# Altium schematic sheet AudioDriver.schDOC
size A3; Organization: Altium Limited; Address1: L3, 12a Rodborough Rd; Address2: Frenchs Forest; Address3: NSW; Address4: Australia 2086; DocumentNumber: 18; SheetNumber: 18; SheetTotal: 22
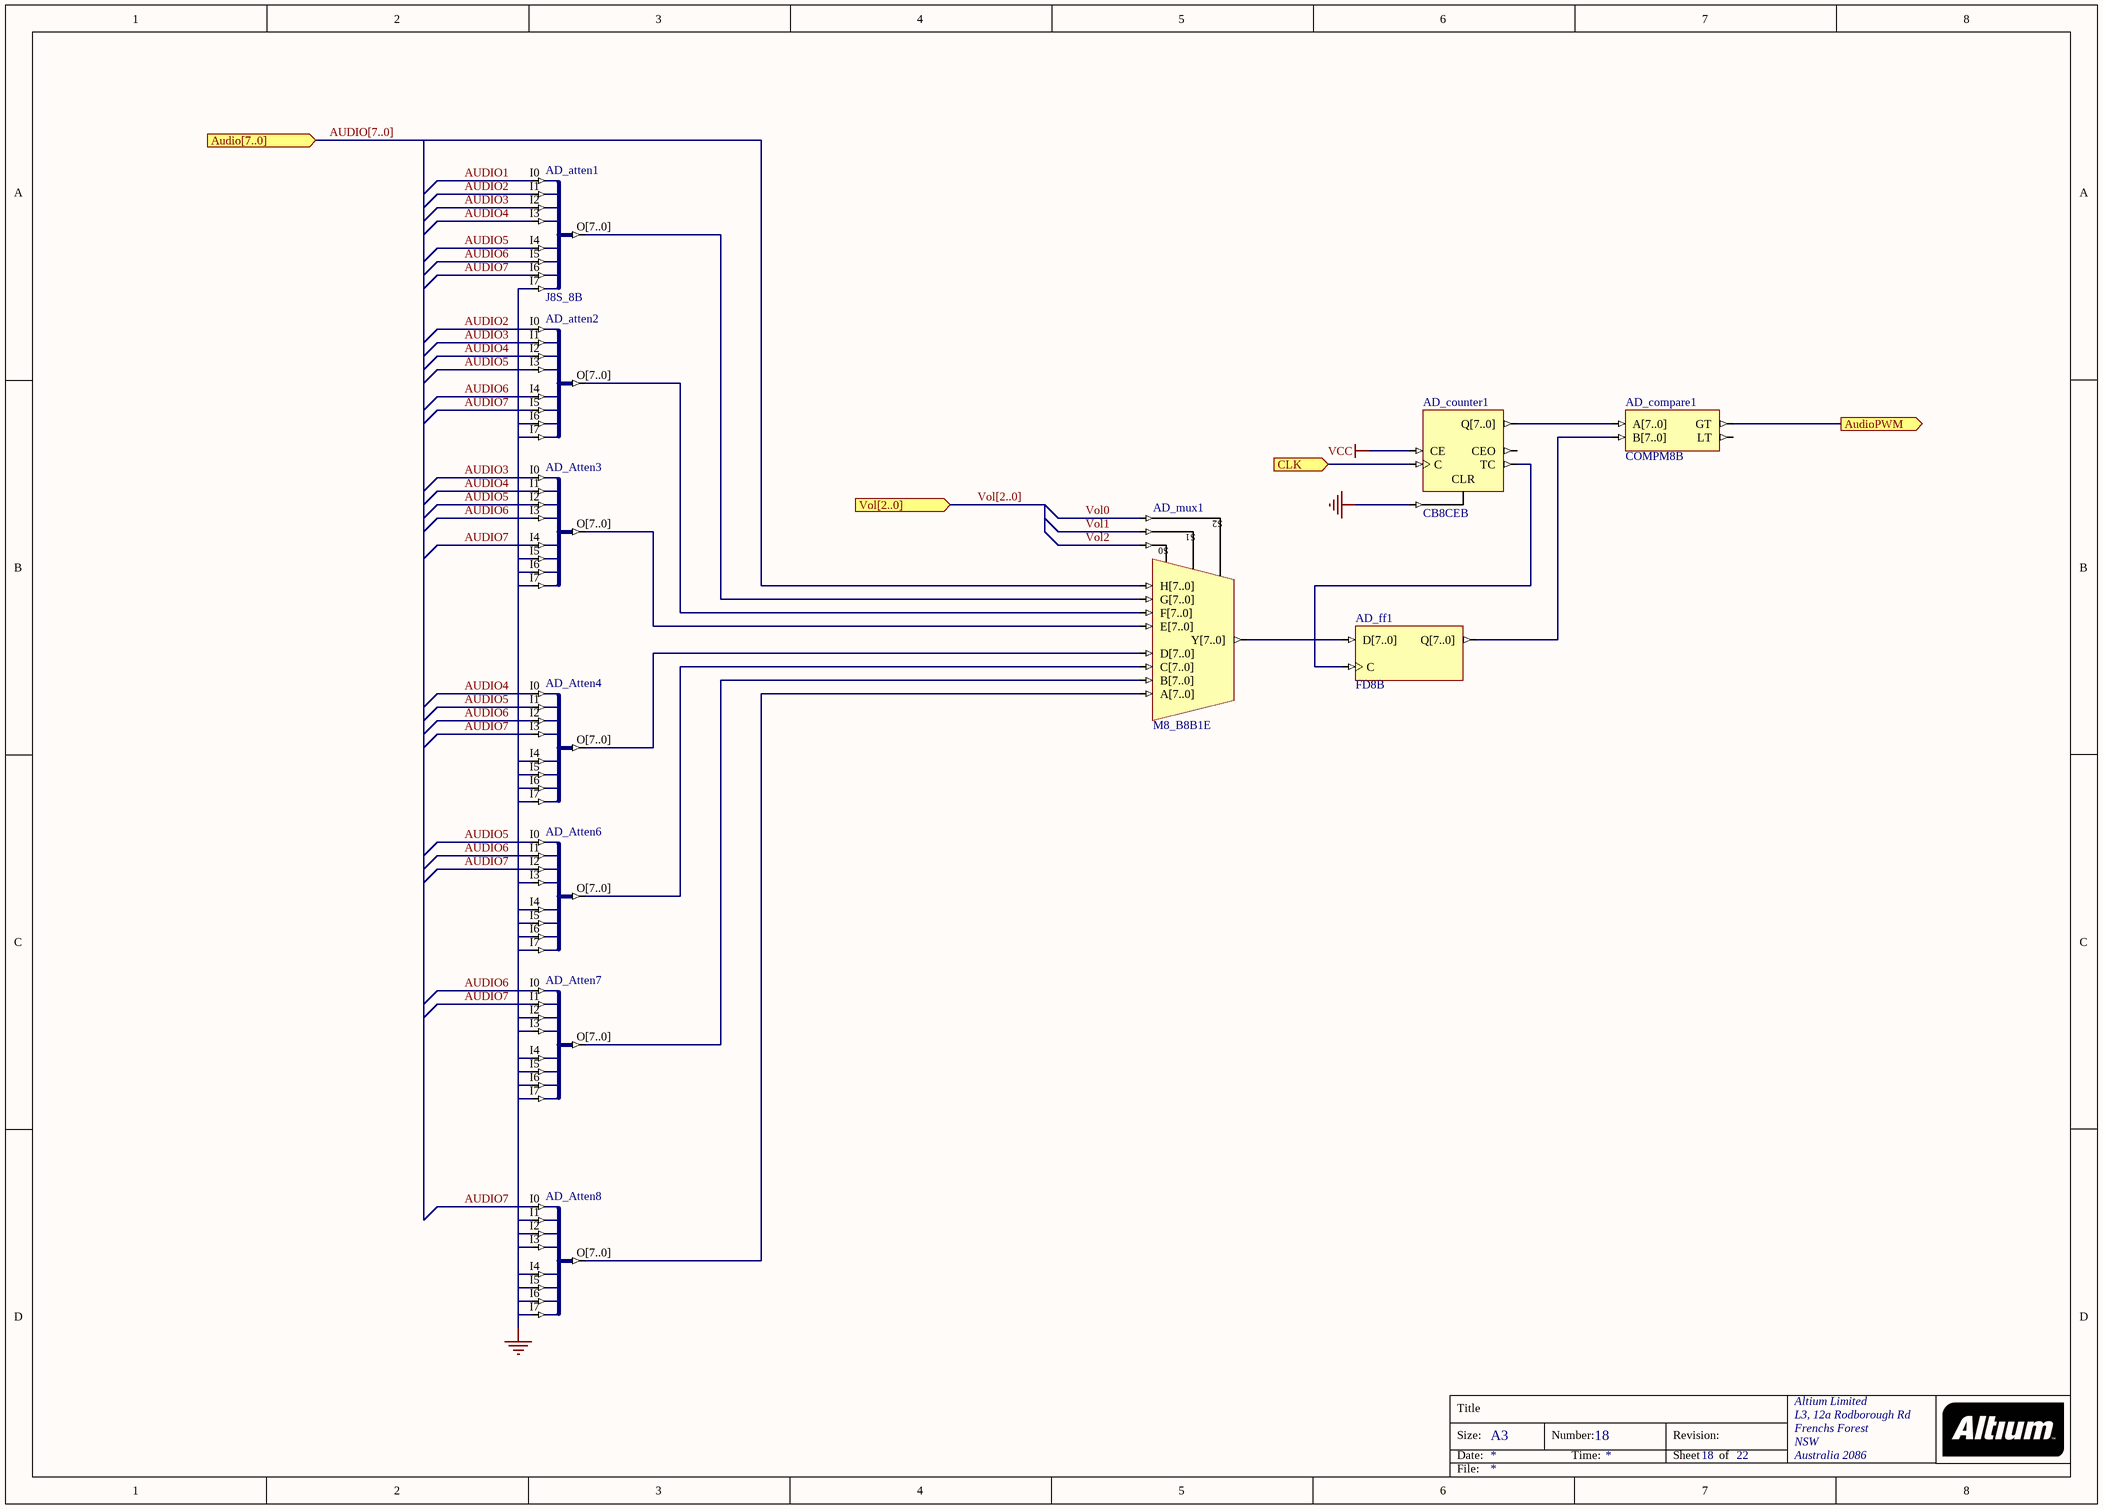
[diagram p0: AudioDriver.schDOC]

## Parts
AD_atten1  J8S_8B
AD_atten2  J8S_8BX  (value not drawn)
AD_Atten3  J8S_8B  (value not drawn)
AD_Atten4  J8S_8B  (value not drawn)
AD_Atten6  J8S_8B  (value not drawn)
AD_Atten7  J8S_8B  (value not drawn)
AD_Atten8  J8S_8B  (value not drawn)
AD_compare1  COMPM8B
AD_counter1  CB8CEB
AD_ff1  FD8B
AD_mux1  M8_B8B1E

## Ports
Audio[7..0] (in), AudioPWM (out), CLK (in), Vol[2..0] (in)

## Nets
GND: AD_atten1.I7 AD_atten2.I6 AD_atten2.I7 AD_Atten3.I5 AD_Atten3.I6 AD_Atten3.I7 AD_Atten4.I4 AD_Atten4.I5 AD_Atten4.I6 AD_Atten4.I7 AD_Atten6.I3 AD_Atten6.I4 AD_Atten6.I5 AD_Atten6.I6 AD_Atten6.I7 AD_Atten7.I2 AD_Atten7.I3 AD_Atten7.I4 AD_Atten7.I5 AD_Atten7.I6 AD_Atten7.I7 AD_Atten8.I1 AD_Atten8.I2 AD_Atten8.I3 AD_Atten8.I4 AD_Atten8.I5 AD_Atten8.I6 AD_Atten8.I7 AD_counter1.CLR
VCC: AD_counter1.CE
AUDIO1: AD_atten1.I0
AUDIO2: AD_atten1.I1 AD_atten2.I0
AUDIO3: AD_atten1.I2 AD_atten2.I1 AD_Atten3.I0
AUDIO4: AD_atten1.I3 AD_atten2.I2 AD_Atten3.I1 AD_Atten4.I0
AUDIO5: AD_atten1.I4 AD_atten2.I3 AD_Atten3.I2 AD_Atten4.I1 AD_Atten6.I0
AUDIO6: AD_atten1.I5 AD_atten2.I4 AD_Atten3.I3 AD_Atten4.I2 AD_Atten6.I1 AD_Atten7.I0
AUDIO7: AD_atten1.I6 AD_atten2.I5 AD_Atten3.I4 AD_Atten4.I3 AD_Atten6.I2 AD_Atten7.I1 AD_Atten8.I0
AUDIO[7..0]: AD_mux1.H[7..0] ; port Audio[7..0]
AudioPWM: AD_compare1.GT ; port AudioPWM
CLK: AD_counter1.C ; port CLK
Vol0: AD_mux1.S2
Vol1: AD_mux1.S1
Vol2: AD_mux1.S0
NetAD_atten1_O[7..0]: AD_atten1.O[7..0] AD_mux1.G[7..0]
NetAD_atten2_O[7..0]: AD_atten2.O[7..0] AD_mux1.F[7..0]
NetAD_Atten3_O[7..0]: AD_Atten3.O[7..0] AD_mux1.E[7..0]
NetAD_Atten4_O[7..0]: AD_Atten4.O[7..0] AD_mux1.D[7..0]
NetAD_Atten6_O[7..0]: AD_Atten6.O[7..0] AD_mux1.C[7..0]
NetAD_Atten7_O[7..0]: AD_Atten7.O[7..0] AD_mux1.B[7..0]
NetAD_Atten8_O[7..0]: AD_Atten8.O[7..0] AD_mux1.A[7..0]
NetAD_compare1_A[7..0]: AD_compare1.A[7..0] AD_counter1.Q[7..0]
NetAD_compare1_B[7..0]: AD_compare1.B[7..0] AD_ff1.Q[7..0]
NetAD_counter1_TC: AD_counter1.TC AD_ff1.C
NetAD_ff1_D[7..0]: AD_ff1.D[7..0] AD_mux1.Y[7..0]

Not connected (* = marked no-connect by the designer): AD_compare1 LT; AD_counter1 CEO

## Buses and harness runs
bus AUDIO[7..0] = port Audio[7..0]
bus Vol[2..0] = port Vol[2..0]

## Notes on the sheet
- Title
- Size:
- Date:
- A3
- Number:
- Time:
- Revision:
- Sheet
- of
- File:

## Library data of the parts
AD_atten1 AD_atten2 AD_Atten3 AD_Atten4 AD_Atten6-AD_Atten8 = J8S_8B: 8 Single pin inputs to single 8-Bit output bus; ArchiveName: GENERIC; Published: 9-30-2003; Publisher: Altium Limited; Core Revision: 1.00.00
AD_compare1 = COMPM8B: 8-Bit Magnitude Comparator, Bus Version; Xilinx Equivalent: COMPM8; ArchiveName: GENERIC; Published: 9-30-2003; Publisher: Altium Limited; Core Revision: 1.00.00
AD_counter1 = CB8CEB: 8-Bit Cascadable Binary Counters with Clock Enable and Asynchronous Clear, Bus Version; Xilinx Equivalent: CB8CE; ArchiveName: GENERIC; Published: 9-30-2003; Publisher: Altium Limited; Core Revision: 1.00.00
AD_ff1 = FD8B: 8-Bit D-Type Flip-Flop, Bus Version; Xilinx Equivalent: FD8; ArchiveName: GENERIC; Published: 9-30-2003; Publisher: Altium Limited; Core Revision: 1.00.00
AD_mux1 = M8_B8B1: 8x8-Bit Bus to 1x8-Bit Bus Multiplexer; ArchiveName: GENERIC; Published: 9-30-2003; Publisher: Altium Limited; Core Revision: 1.00.00